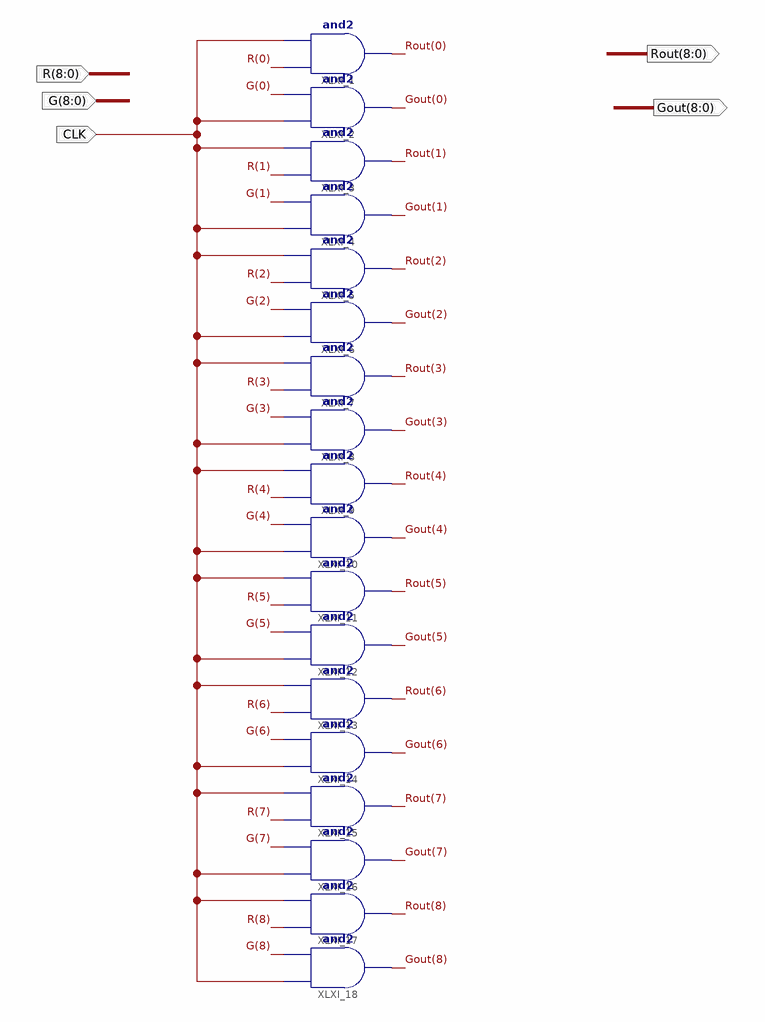
[diagram p0: schematic sheet 1]
// Xilinx ISE schematic Blink.sch (spartan6) as structural Verilog: 18 symbols, 5 ports
module Blink (
  input  [8:0] R,
  input  [8:0] G,
  input  CLK,
  output [8:0] Rout,
  output [8:0] Gout
);

  and XLXI_1 (Rout[0], R[0], CLK);
  and XLXI_2 (Gout[0], CLK, G[0]);
  and XLXI_3 (Rout[1], R[1], CLK);
  and XLXI_4 (Gout[1], CLK, G[1]);
  and XLXI_5 (Rout[2], R[2], CLK);
  and XLXI_6 (Gout[2], CLK, G[2]);
  and XLXI_7 (Rout[3], R[3], CLK);
  and XLXI_8 (Gout[3], CLK, G[3]);
  and XLXI_9 (Rout[4], R[4], CLK);
  and XLXI_10 (Gout[4], CLK, G[4]);
  and XLXI_11 (Rout[5], R[5], CLK);
  and XLXI_12 (Gout[5], CLK, G[5]);
  and XLXI_13 (Rout[6], R[6], CLK);
  and XLXI_14 (Gout[6], CLK, G[6]);
  and XLXI_15 (Rout[7], R[7], CLK);
  and XLXI_16 (Gout[7], CLK, G[7]);
  and XLXI_17 (Rout[8], R[8], CLK);
  and XLXI_18 (Gout[8], CLK, G[8]);
endmodule
